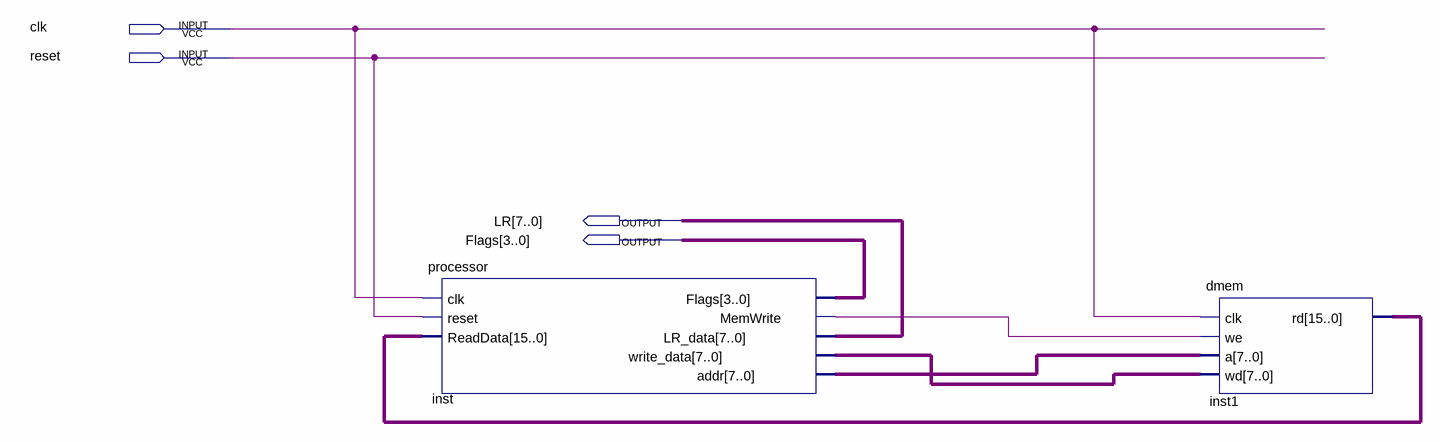
[diagram p0: schematic sheet]
// Quartus schematic toplevel.bdf as structural Verilog: 2 symbols, 4 pins
module toplevel (
  input  clk,
  input  reset,
  output [7:0] LR,
  output [3:0] Flags
);

  wire inst_memwrite;
  wire [7:0] inst_addr, inst_write_data;
  wire [15:0] inst1_rd;

  processor inst (
    .clk(clk), .reset(reset), .ReadData(inst1_rd), .Flags(Flags), .MemWrite(inst_memwrite), .LR_data(LR),
    .write_data(inst_write_data), .addr(inst_addr));
  dmem inst1 (.clk(clk), .we(inst_memwrite), .a(inst_addr), .wd(inst_write_data), .rd(inst1_rd));
endmodule
